# Altium schematic sheet ADJ_REG.SchDoc
size A4; SheetNumber: 2; SheetTotal: 2
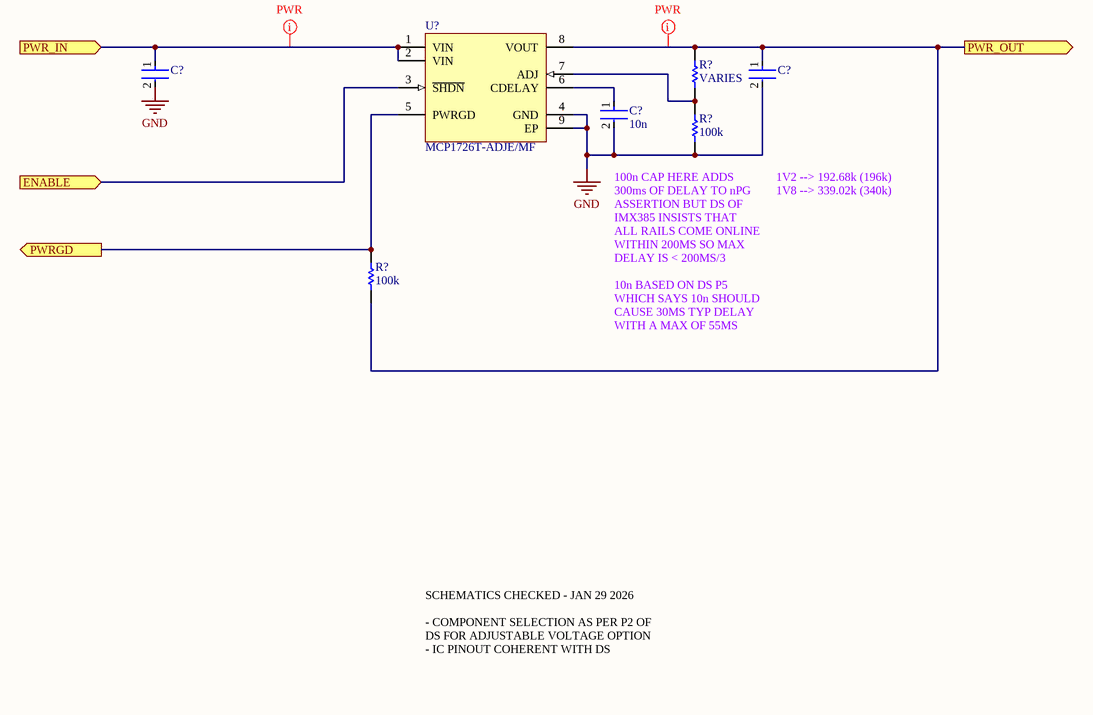
[diagram p0: ADJ_REG.SchDoc]

## Parts
(Parts that share a designator on the sheet are numbered #1, #2 ... from top to bottom, then left to right.)
C?#1  C0805C475J4RACAUTO  [FP-C0805C475J4RACAUTO-MFG]  (value not drawn)
C?#2  08051C105K4T2A  [FP-0805-L_2_01_0_2-W_1_25-MFG]  (value not drawn)
C?#3  10n  [FP-0402-L_1_0_0_05-W_0_5-IPC_A]
R?#1  VARIES  [R0603B]
R?#2  100k  [R0603B]
R?#3  100k  [R0603B]
U?  MCP1726T-ADJE/MF  [DFN-MF8]

## Ports
ENABLE (in), PWR_IN (in), PWR_OUT (out), PWRGD (out)

## Nets
GND: C?#1.2 C?#2.2 C?#3.2 R?#2.1 U?.4(GND) U?.9(EP)
ENABLE: U?.3(~{SHDN}) ; port ENABLE
PWR_IN: C?#1.1 U?.1(VIN) U?.2(VIN) ; port PWR_IN
PWR_OUT: C?#2.1 R?#1.2 R?#3.2 U?.8(VOUT) ; port PWR_OUT
PWRGD: R?#3.1 U?.5(PWRGD) ; port PWRGD
NetC?#3_1: C?#3.1 U?.6(CDELAY)
NetR?#1_1: R?#1.1 R?#2.2 U?.7(ADJ)

## Layout directives
net class PWR: PWR_IN, PWR_OUT

## Notes on the sheet
- 1V2 --> 192.68k (196k)
  1V8 --> 339.02k (340k)
- (near R?#2) 100n CAP HERE ADDS 300ms OF DELAY TO nPG ASSERTION BUT DS OF IMX385 INSISTS THAT ALL RAILS COME ONLINE WITHIN 200MS SO MAX DELAY IS < 200MS/3
  10n BASED ON DS P5 WHICH SAYS 10n SHOULD CAUSE 30MS TYP DELAY WITH A MAX OF 55MS
- SCHEMATICS CHECKED - JAN 29 2026
  - COMPONENT SELECTION AS PER P2 OF DS FOR ADJUSTABLE VOLTAGE OPTION
  - IC PINOUT COHERENT WITH DS

## Library data of the parts
C?#1 = CMP-00212-84766729-1: C0805C475J4RACAUTO Cap Ceramic 4.7uF 16V X7R 5% Pad SMD 0805 125C Automotive T/R; Capacitance: 4.7µF; Max Operating Temperature: 125°C; Dielectric Material: Ceramic; Voltage Rating (DC): 16V; Dielectric: X7R; Height: 1.4mm; Case/Package: 0805; NexarPartId: 84766729; Voltage Rating: 16V; RoHS: Compliant; Material: Ceramic; Packaging: Cut Tape; Tolerance: 5%; Min Operating Temperature: -55°C
C?#2 = CMP-07738-122049624-1: 08051C105K4T2A Cap Ceramic 1uF 100V X7R 10% Pad SMD 0805 125C Automotive T/R; Capacitance: 1µF; Tolerance: 10%; Dielectric: X7R; Case/Package: 0805; Material: Ceramic; Height: 1.4mm; Voltage Rating (DC): 100V; Voltage Rating: 100V; Schedule B: 8532240020; NexarPartId: 122049624; RoHS: Compliant; Lifecycle Status: Production; Min Operating Temperature: -55°C; Max Operating Temperature: 125°C
C?#3 = CMP-001-00058-1: LARGE PADS, 0402 CAP, CHANGE COMMENT TO MATCH REAL P/N; Capacitor Type: Ceramic; Min Operating Temperature: -55°C; Mounting Technology: Surface Mount; Pins: 2; Case/Package: 0402; RoHS Compliant: Yes; Max Operating Temperature: 85°C
R?#1 R?#3 = CMP-009-00002-14: Resistor
  R?#1: Value: VARIES
  R?#3: Value: 100k
R?#2 = CMP-009-00002-14: Resistor; Value: 10k
U? = CMP-0136-00358-1: 1A, Low Voltage, Low Quiescent Current LDO Regulator, 8-Pin DFN, Extended Temperature, Tape and Reel; DatasheetVersion: revC, Aug-2007; PackageDescription: 8-Lead Plastic Dual Flat, No Lead Package (MF) - 3x3x0.9mm Body [DFN]; PackageVersion: revBB, Aug-2009; PackageReference: DFN-MF8